# Altium schematic sheet Pixel1.0_2.SchDoc: Pixel1.0
size 409 x 282 mm; Date: 5/11/2016 6:59:09 PM; SheetNumber: 3
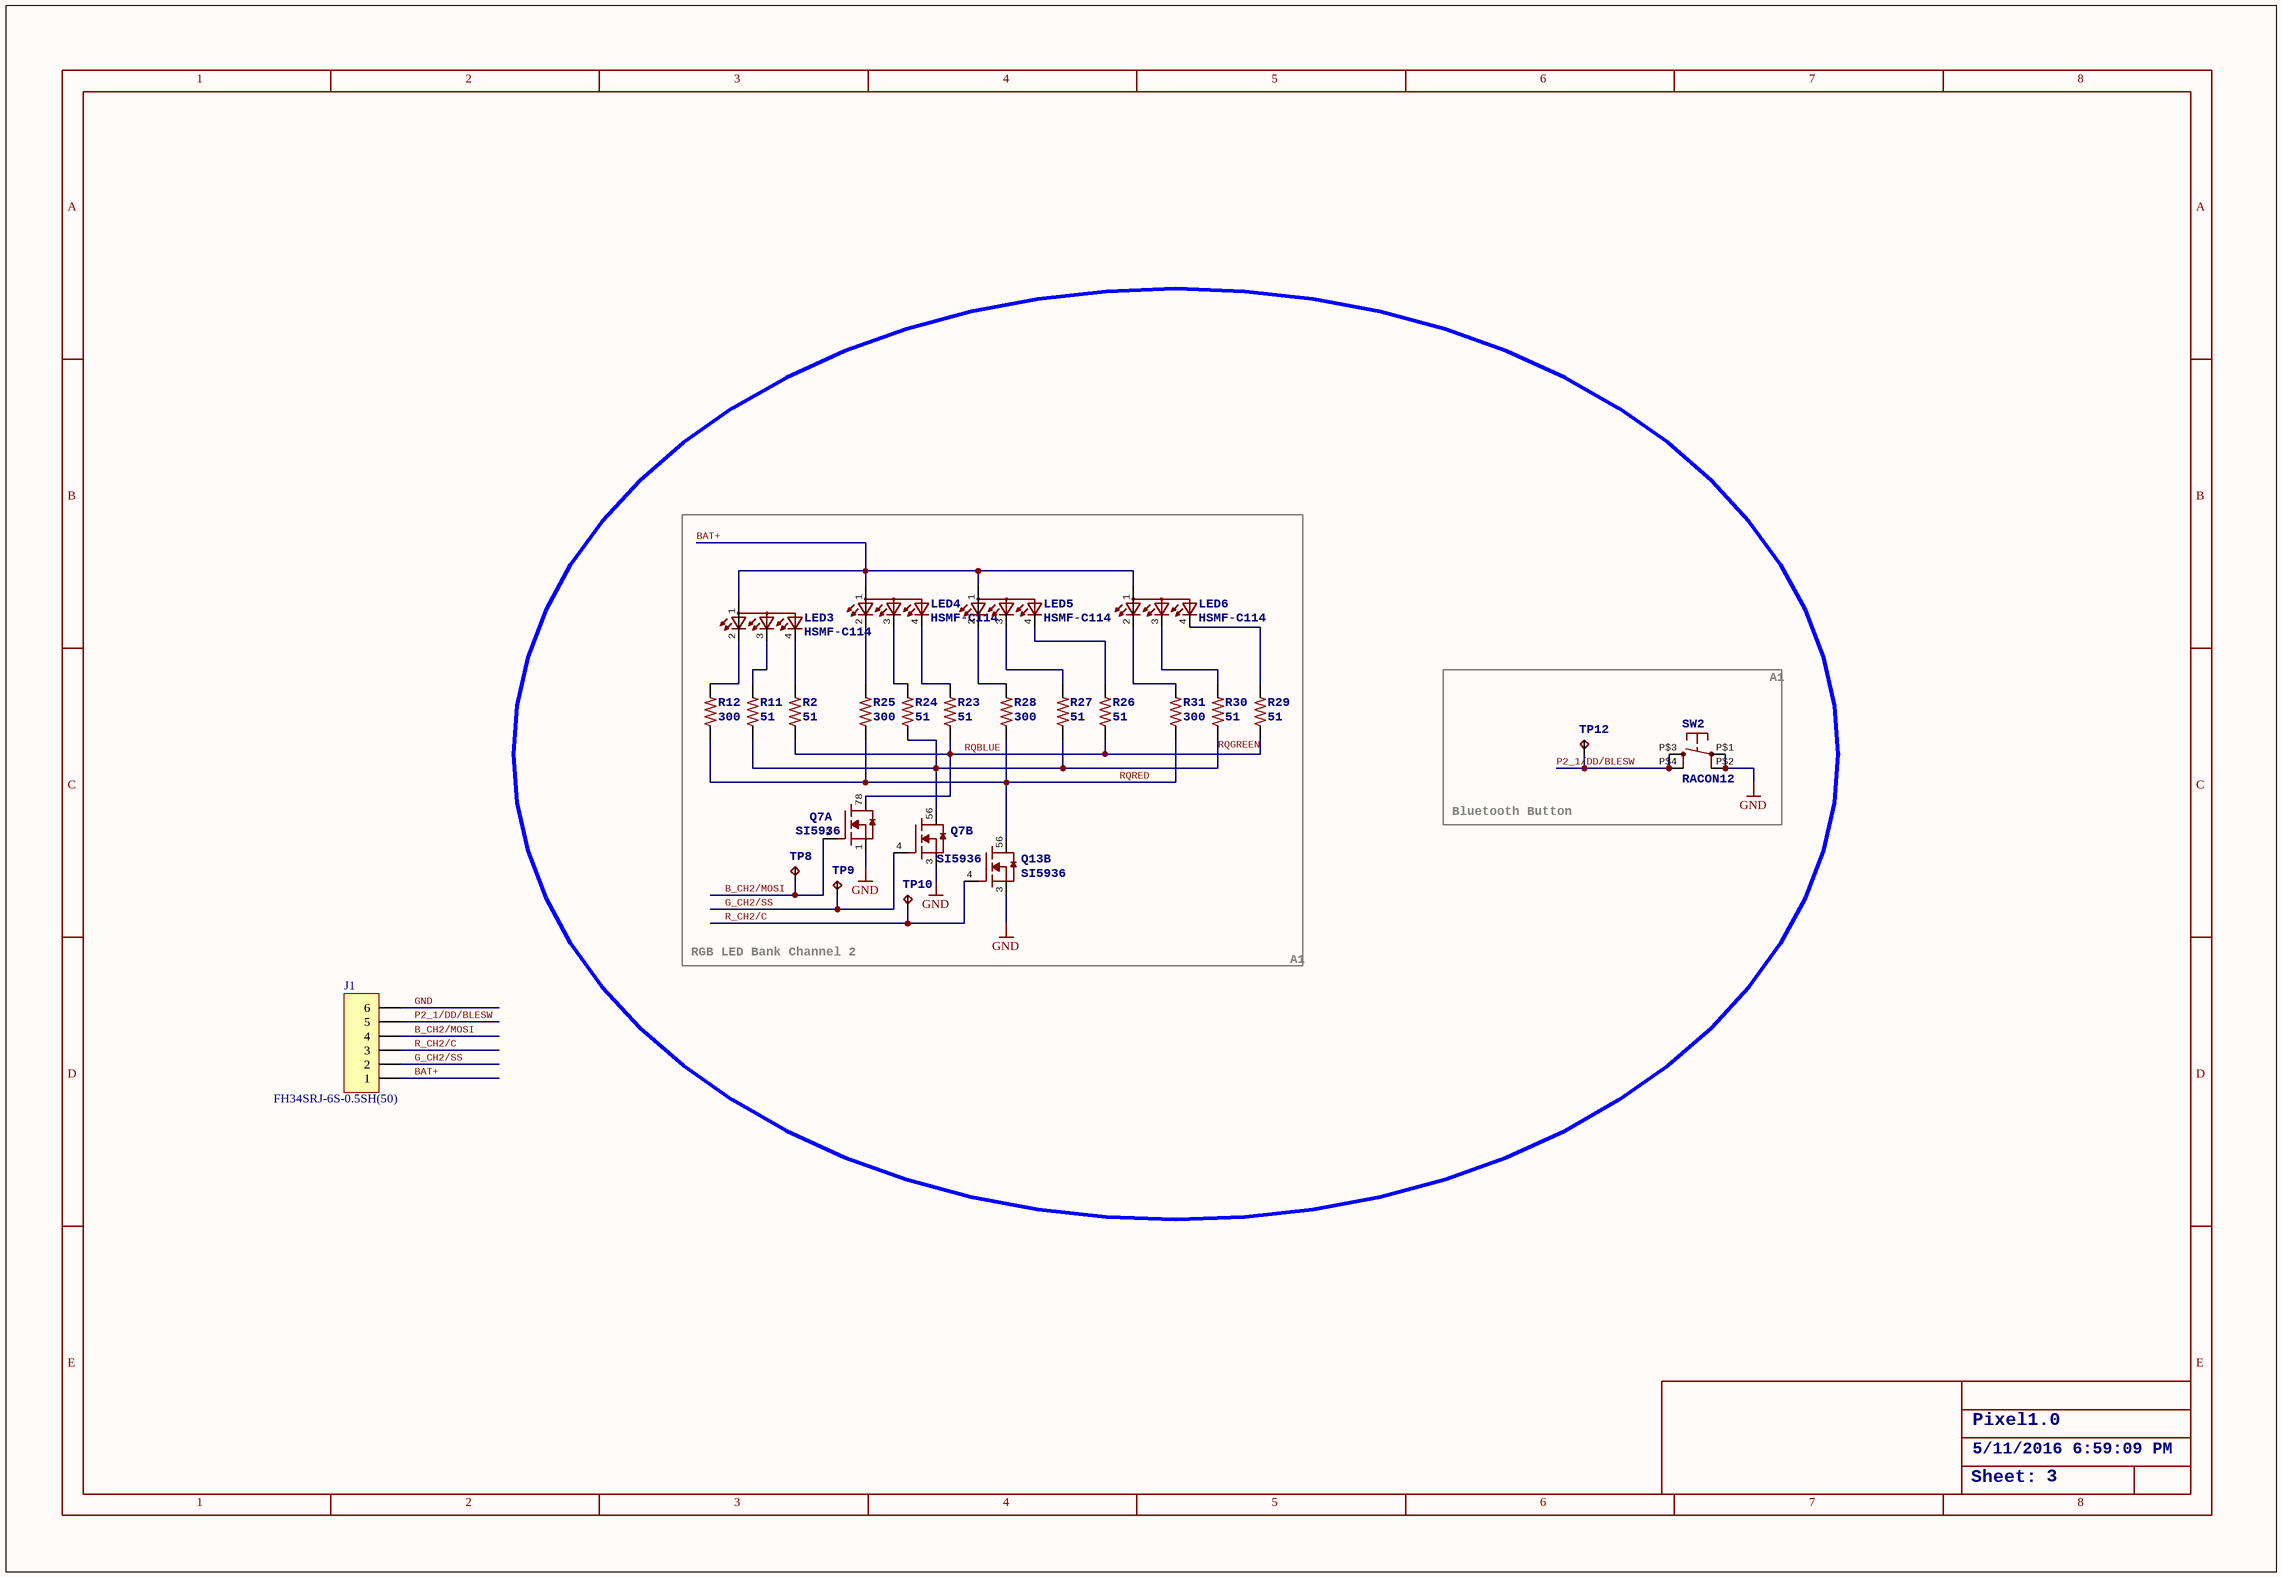
[diagram p0: Pixel1.0_2.SchDoc]

## Parts
J1  FH34SRJ-6S-0.5SH(50)  [59453061110ECHLF]
LED3  HSMF-C114  [HSMFC114]
LED4  HSMF-C114  [HSMFC114]
LED5  HSMF-C114  [HSMFC114]
LED6  HSMF-C114  [HSMFC114]
Q7  SI5936  [1206-8CHIP-FET]  (parts A,B of 2)
Q13  SI5936  [1206-8CHIP-FET]  (part B of 2)
R2  51  [R0201]
R11  51  [R0201]
R12  300  [R0201]
R23  51  [R0201]
R24  51  [R0201]
R25  300  [R0201]
R26  51  [R0201]
R27  51  [R0201]
R28  300  [R0201]
R29  51  [R0201]
R30  51  [R0201]
R31  300  [R0201]
SW2  RACON12  [RACON12]
TP8  TPTP06R  [TP06R]  (value not drawn)
TP9  TPTP06R  [TP06R]  (value not drawn)
TP10  TPTP06R  [TP06R]  (value not drawn)
TP12  TPTP06R  [TP06R]  (value not drawn)

## Nets
GND: J1.6 Q7.1(S1) Q7.3(S2) Q13.3(S2) SW2.P$1(P) SW2.P$2(P)
B_CH2/MOSI: J1.4 Q7.2(G1) TP8.TP
BAT+: J1.1 LED3.1(A) LED4.1(A) LED5.1(A) LED6.1(A)
G_CH2/SS: J1.2 Q7.4(G2) TP9.TP
P2_1/DD/BLESW: J1.5 SW2.P$3(S) SW2.P$4(S) TP12.TP
R_CH2/C: J1.3 Q13.4(G2) TP10.TP
RQBLUE: Q7.78(D1) R2.1 R23.1 R26.1 R29.1
RQGREEN: Q7.56(D2) R11.1 R24.1 R27.1 R30.1
RQRED: Q13.56(D2) R12.1 R25.1 R28.1 R31.1
NetLED3_2: LED3.2(RED) R12.2
NetLED3_3: LED3.3(GREEN) R11.2
NetLED3_4: LED3.4(BLUE) R2.2
NetLED4_2: LED4.2(RED) R25.2
NetLED4_3: LED4.3(GREEN) R24.2
NetLED4_4: LED4.4(BLUE) R23.2
NetLED5_2: LED5.2(RED) R28.2
NetLED5_3: LED5.3(GREEN) R27.2
NetLED5_4: LED5.4(BLUE) R26.2
NetLED6_2: LED6.2(RED) R31.2
NetLED6_3: LED6.3(GREEN) R30.2
NetLED6_4: LED6.4(BLUE) R29.2

## Notes on the sheet
- A1
- Bluetooth Button
- RGB LED Bank Channel 2
- Pixel1.0
- 5/11/2016 6:59:09 PM
- Sheet:
- 3
- 1
- 2
- 4
- 5
- 6
- 7
- 8
- A
- B
- C
- D
- E

## Library data of the parts
J1 = WE-ZIF Connector WR-FPC 68710614522: WR-FPC 0.50mm SMT ZIF Horizontal Bottom Contact; Manufacturer: W¨¹rth Elektronik eiSos GmbH; ComponentLink1 Description: Manufacturer; ComponentLink2 Description: Datasheet; NoPins: 06; Created Date: 28 October 2013; partNo: 68710614522; ComponentLink1URL: http://www.we-online.com; ComponentLink2URL: http://katalog.we-online.de/em/datasheet/6871xx14522.pdf; Created by: Karrer Zheng
LED3-LED6 = HSMF-C114: Chip LED RGB   Source: http://document.sharpsma.com/files/GM1WA55311A_SS.pdf
R2 R11 R12 R23-R31 = R-US_R0201: RESISTOR, American symbol
SW2 = RACON12: ITT SWITCH
TP8-TP10 TP12 = TPTP06R: Test pad